# Altium schematic sheet SFPGA.SchDoc: System FPGA
size 594 x 420 mm; CheckedBy: T.Janicki; CompanyName: Creotech Instruments SA; DrawnBy: G.Kasprowicz; Organization: CERN; Address1: European Organization for Nuclear Research; Address2: CH-1211 Genève 23 - Switzerland; Revision: -; SheetNumber: 8; SheetTotal: 11; EDA_Number: EDA-xxxx; Projet: Simple VME FMC Carrier; ModifiedBy: -; CreateDate: 20/11/2012; CheckedDate: 23/01/2012; DivGrp: BE-CO; Designer: G.Kasprowicz; PageSetup: Record=PageOptions|CenterHorizontal=True|CenterVertical=True|PrintScale=0.67|XCorrection=1.00|YCorrection=1.00|PrintKind=1|BorderSize=5000000|LeftOffset=0|BottomOffset=0|Orientation=2|PaperLength=1000|PaperWidth=1000|Scale=100|PaperSource=15|PrintQuality=600|MediaType=1|DitherType=10|PaperKind=A3|PrintScaleMode=1; ModifiedDate: -
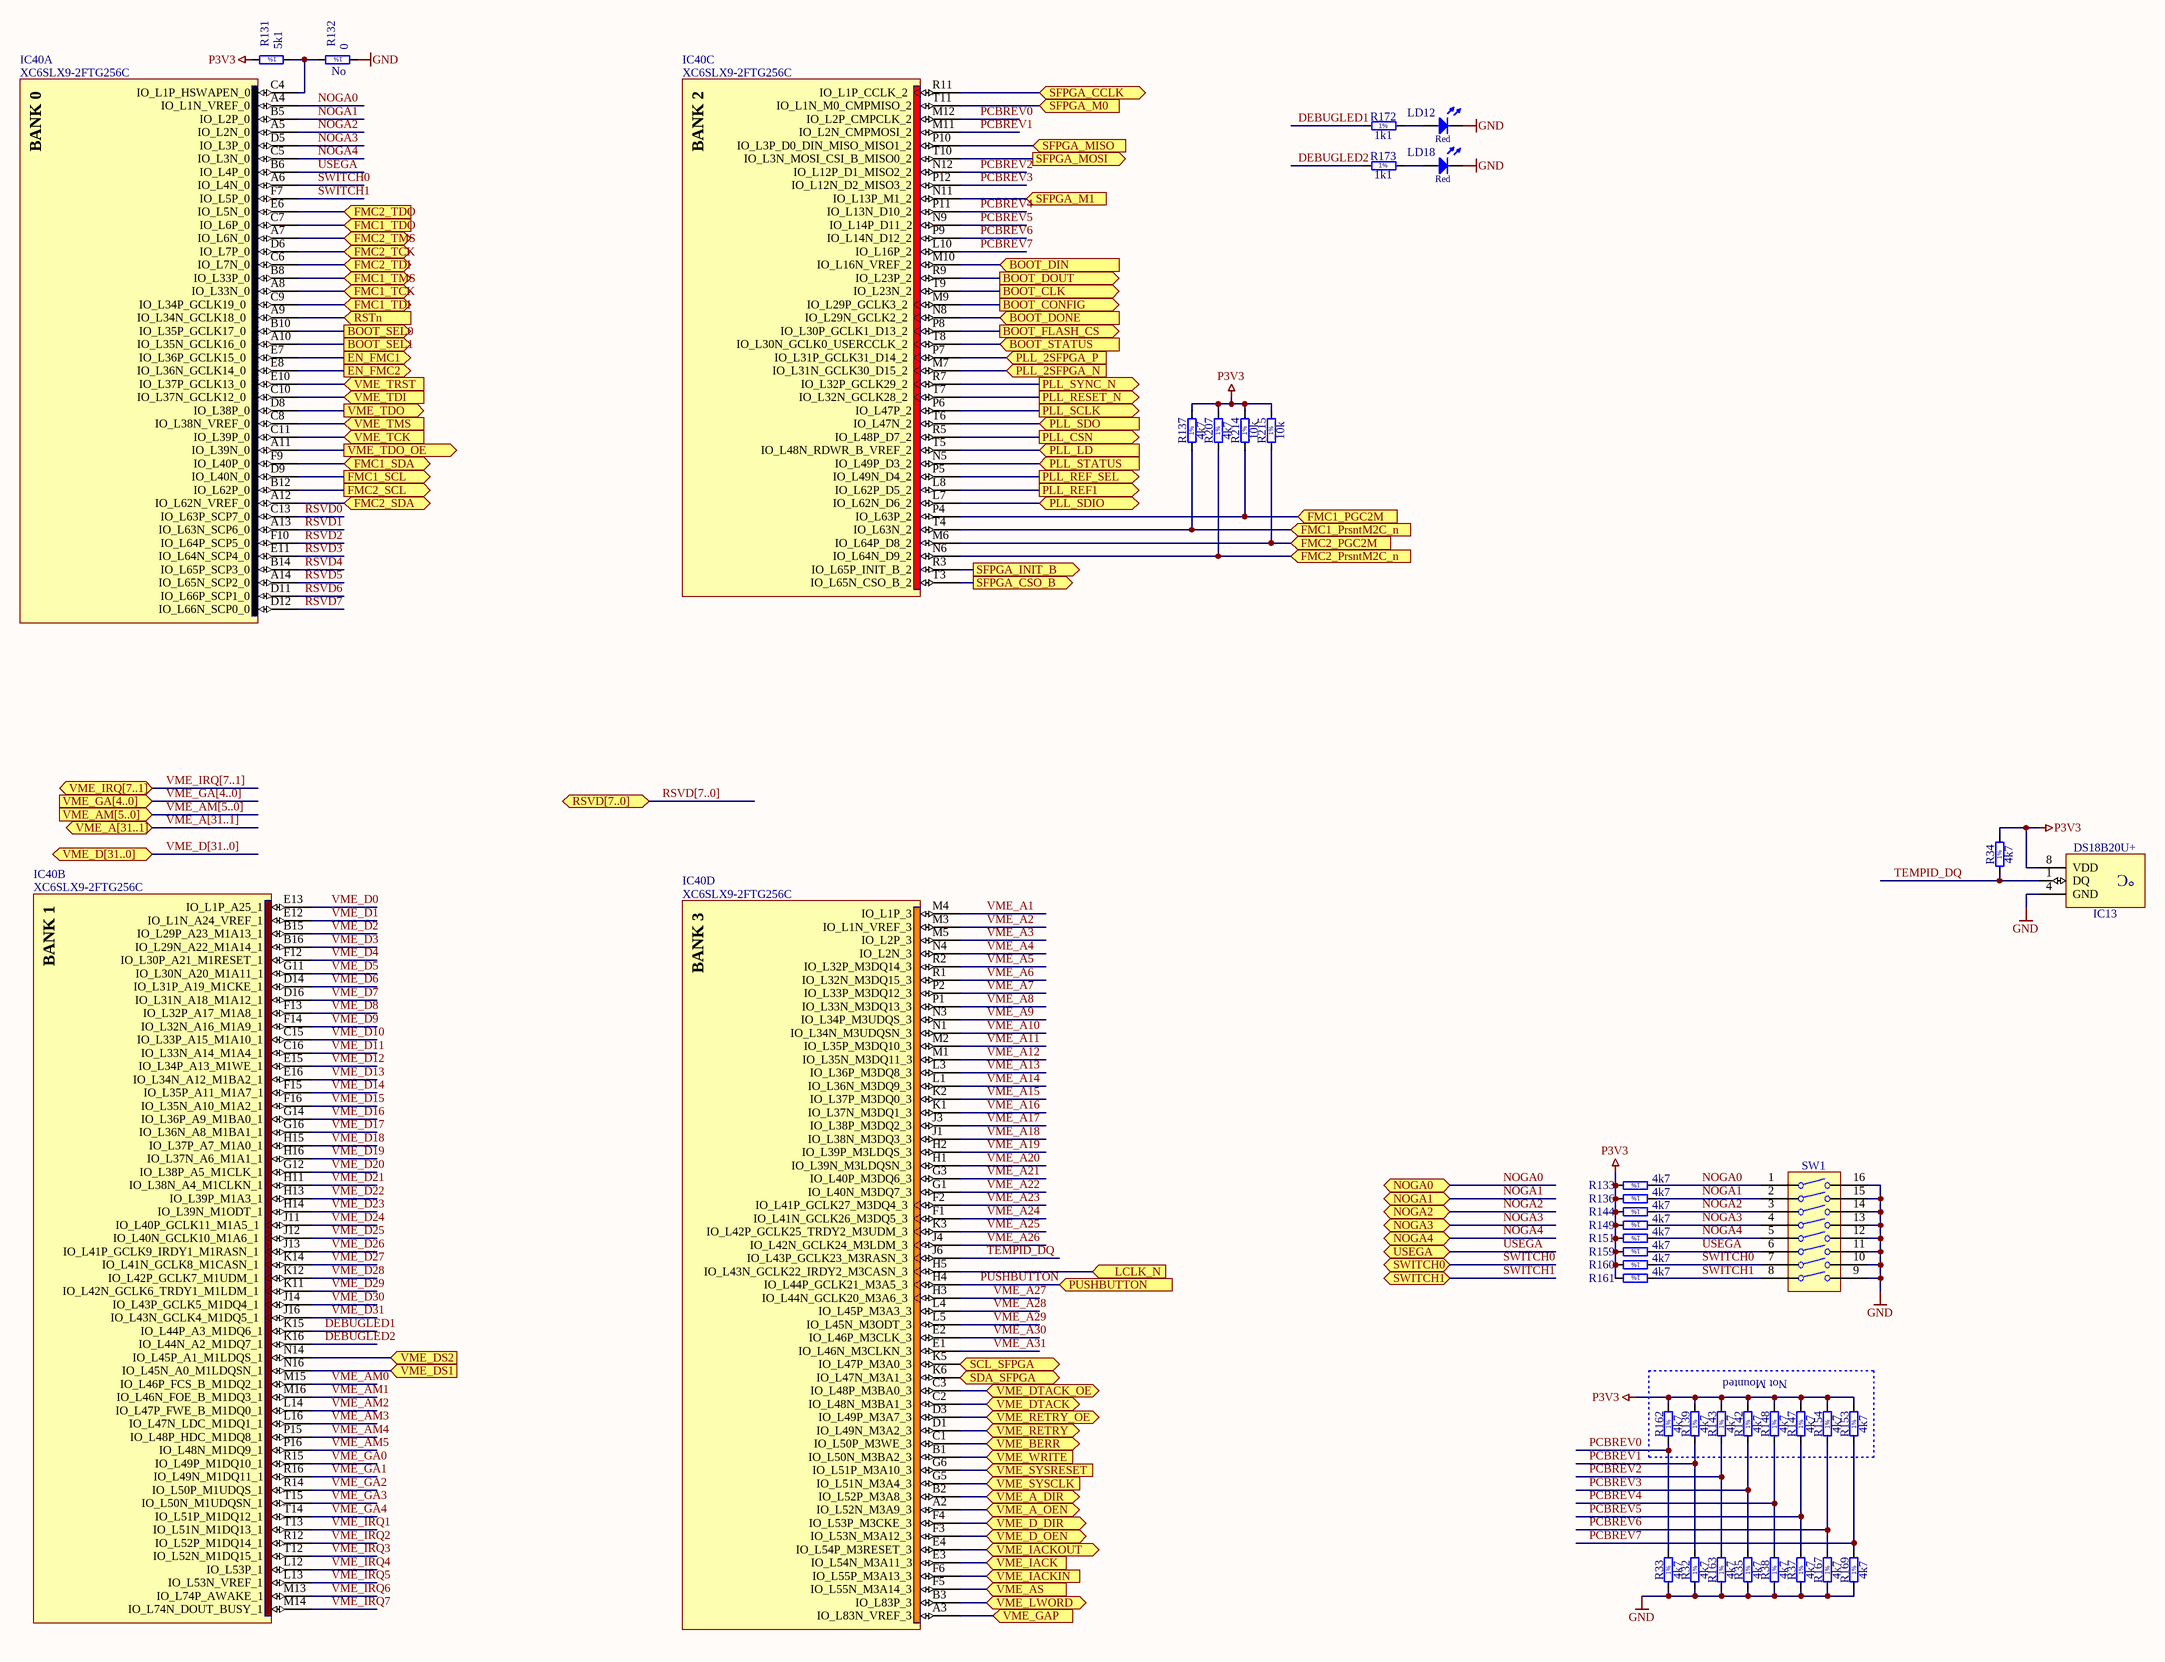
[diagram p0: SFPGA.SchDoc]

## Parts
IC13  DS18B20U+  [SOP65P490X110-8N]
IC40  XC6SLX9-2FTG256C  [BGA256C100P16X16_1700X1700X155]  (parts A,B,C,D of 7)
LD12  Red  [LEDC1608X80N_RED]  (value not drawn)
LD18  Red  [LEDC1608X80N_RED]  (value not drawn)
R32  4k7  [RESC1608X55N]
R33  4k7  [RESC1608X55N]
R34  4k7  [RESC1608X55N]
R35  4k7  [RESC1608X55N]
R37  4k7  [RESC1608X55N]
R38  4k7  [RESC1608X55N]
R131  5k1  [RESC1608X55N]
R132  0  Mounted: No  [RESC1608X55N]
R133  4k7  [RESC1608X55N]
R136  4k7  [RESC1608X55N]
R137  4k7  [RESC1608X55N]
R139  4k7  [RESC1608X55N]
R142  4k7  [RESC1608X55N]
R143  4k7  [RESC1608X55N]
R144  4k7  [RESC1608X55N]
R147  4k7  [RESC1608X55N]
R148  4k7  [RESC1608X55N]
R149  4k7  [RESC1608X55N]
R151  4k7  [RESC1608X55N]
R153  4k7  [RESC1608X55N]
R154  4k7  [RESC1608X55N]
R159  4k7  [RESC1608X55N]
R160  4k7  [RESC1608X55N]
R161  4k7  [RESC1608X55N]
R162  4k7  [RESC1608X55N]
R163  4k7  [RESC1608X55N]
R167  4k7  [RESC1608X55N]
R169  4k7  [RESC1608X55N]
R172  1k1  [RESC1608X55N]
R173  1k1  [RESC1608X55N]
R207  4k7  [RESC1608X55N]
R214  10k  [RESC1608X55N]
R215  10k  [RESC1608X55N]
SW1  Switch  [SW_TYCO_1-1571983-0]  (value not drawn)

## Blocks framed on the sheet
Not Mounted: R139 R142 R143 R147 R148 R153 R154 R162

## Ports
BOOT_CLK (out), BOOT_CONFIG (out), BOOT_DIN (in), BOOT_DONE (in), BOOT_DOUT (out), BOOT_FLASH_CS (out), BOOT_SEL0 (out), BOOT_SEL1 (out), BOOT_STATUS (in), EN_FMC1 (out), EN_FMC2 (out), FMC1_PGC2M (in), FMC1_PrsntM2C_n (in), FMC1_SCL (out), FMC1_SDA (bidir), FMC1_TCK (bidir), FMC1_TDI (bidir), FMC1_TDO (in), FMC1_TMS (bidir), FMC2_PGC2M (in), FMC2_PrsntM2C_n (in), FMC2_SCL (out), FMC2_SDA (bidir), FMC2_TCK (bidir), FMC2_TDI (bidir), FMC2_TDO (in), FMC2_TMS (bidir), LCLK_N (in), NOGA0 (bidir), NOGA1 (bidir), NOGA2 (bidir), NOGA3 (bidir), NOGA4 (bidir), PLL_2SFPGA_N (in), PLL_2SFPGA_P (in), PLL_CSN (out), PLL_LD (in), PLL_REF1 (out), PLL_REF_SEL (out), PLL_RESET_N (out), PLL_SCLK (out), PLL_SDIO (bidir), PLL_SDO (in), PLL_STATUS (in), PLL_SYNC_N (out), PUSHBUTTON (in), RSTn (in), RSVD[7..0] (bidir), SCL_SFPGA (out), SDA_SFPGA (bidir), SFPGA_CCLK (bidir), SFPGA_CSO_B (out), SFPGA_INIT_B (out), SFPGA_M0 (in), SFPGA_M1 (in), SFPGA_MISO (in), SFPGA_MOSI (out), SWITCH0 (bidir), SWITCH1 (bidir), USEGA (bidir), VME_A[31..1] (bidir), VME_A_DIR (bidir), VME_A_OEN (bidir), VME_AM[5..0] (in), VME_AS (in), VME_BERR (bidir), VME_D[31..0] (bidir), VME_D_DIR (bidir), VME_D_OEN (bidir), VME_DS1 (in), VME_DS2 (in), VME_DTACK (bidir), VME_DTACK_OE (bidir), VME_GA[4..0] (in), VME_GAP (in), VME_IACK (in), VME_IACKIN (in), VME_IACKOUT (bidir), VME_IRQ[7..1] (bidir), VME_LWORD (bidir), VME_RETRY (bidir), VME_RETRY_OE (bidir), VME_SYSCLK (in), VME_SYSRESET (in), VME_TCK (in), VME_TDI (in), VME_TDO (out), VME_TDO_OE (out), VME_TMS (in), VME_TRST (in), VME_WRITE (in)

## Nets
GND: IC13.4(GND) LD12.1(C) LD18.1(C) R32.1 R33.1 R35.1 R37.1 R38.1 R132.1 R163.1 R167.1 R169.1 SW1.9 SW1.10 SW1.11 SW1.12 SW1.13 SW1.14 SW1.15 SW1.16
P3V3: IC13.8(VDD) R34.2 R131.2 R133.2 R136.2 R137.2 R139.2 R142.2 R143.2 R144.2 R147.2 R148.2 R149.2 R151.2 R153.2 R154.2 R159.2 R160.2 R161.2 R162.2 R207.2 R214.2 R215.2
BOOT_CLK: IC40.T9(IO_L23N_2) ; port BOOT_CLK
BOOT_CONFIG: IC40.M9(IO_L29P_GCLK3_2) ; port BOOT_CONFIG
BOOT_DIN: IC40.M10(IO_L16N_VREF_2) ; port BOOT_DIN
BOOT_DONE: IC40.N8(IO_L29N_GCLK2_2) ; port BOOT_DONE
BOOT_DOUT: IC40.R9(IO_L23P_2) ; port BOOT_DOUT
BOOT_FLASH_CS: IC40.P8(IO_L30P_GCLK1_D13_2) ; port BOOT_FLASH_CS
BOOT_SEL0: IC40.B10(IO_L35P_GCLK17_0) ; port BOOT_SEL0
BOOT_SEL1: IC40.A10(IO_L35N_GCLK16_0) ; port BOOT_SEL1
BOOT_STATUS: IC40.T8(IO_L30N_GCLK0_USERCCLK_2) ; port BOOT_STATUS
DEBUGLED1: IC40.K15(IO_L44P_A3_M1DQ6_1) R172.1
DEBUGLED2: IC40.K16(IO_L44N_A2_M1DQ7_1) R173.1
EN_FMC1: IC40.E7(IO_L36P_GCLK15_0) ; port EN_FMC1
EN_FMC2: IC40.E8(IO_L36N_GCLK14_0) ; port EN_FMC2
FMC1_PGC2M: IC40.P4(IO_L63P_2) R214.1 ; port FMC1_PGC2M
FMC1_PrsntM2C_n: IC40.T4(IO_L63N_2) R137.1 ; port FMC1_PrsntM2C_n
FMC1_SCL: IC40.D9(IO_L40N_0) ; port FMC1_SCL
FMC1_SDA: IC40.F9(IO_L40P_0) ; port FMC1_SDA
FMC1_TCK: IC40.A8(IO_L33N_0) ; port FMC1_TCK
FMC1_TDI: IC40.C9(IO_L34P_GCLK19_0) ; port FMC1_TDI
FMC1_TDO: IC40.C7(IO_L6P_0) ; port FMC1_TDO
FMC1_TMS: IC40.B8(IO_L33P_0) ; port FMC1_TMS
FMC2_PGC2M: IC40.M6(IO_L64P_D8_2) R215.1 ; port FMC2_PGC2M
FMC2_PrsntM2C_n: IC40.N6(IO_L64N_D9_2) R207.1 ; port FMC2_PrsntM2C_n
FMC2_SCL: IC40.B12(IO_L62P_0) ; port FMC2_SCL
FMC2_SDA: IC40.A12(IO_L62N_VREF_0) ; port FMC2_SDA
FMC2_TCK: IC40.D6(IO_L7P_0) ; port FMC2_TCK
FMC2_TDI: IC40.C6(IO_L7N_0) ; port FMC2_TDI
FMC2_TDO: IC40.E6(IO_L5N_0) ; port FMC2_TDO
FMC2_TMS: IC40.A7(IO_L6N_0) ; port FMC2_TMS
LCLK_N: IC40.H5(IO_L43N_GCLK22_IRDY2_M3CASN_3) ; port LCLK_N
NOGA0: IC40.A4(IO_L1N_VREF_0) R133.1 SW1.1 ; port NOGA0
NOGA1: IC40.B5(IO_L2P_0) R136.1 SW1.2 ; port NOGA1
NOGA2: IC40.A5(IO_L2N_0) R144.1 SW1.3 ; port NOGA2
NOGA3: IC40.D5(IO_L3P_0) R149.1 SW1.4 ; port NOGA3
NOGA4: IC40.C5(IO_L3N_0) R151.1 SW1.5 ; port NOGA4
PCBREV0: IC40.M12(IO_L2P_CMPCLK_2) R33.2 R162.1
PCBREV1: IC40.M11(IO_L2N_CMPMOSI_2) R32.2 R139.1
PCBREV2: IC40.N12(IO_L12P_D1_MISO2_2) R143.1 R163.2
PCBREV3: IC40.P12(IO_L12N_D2_MISO3_2) R35.2 R142.1
PCBREV4: IC40.P11(IO_L13N_D10_2) R38.2 R148.1
PCBREV5: IC40.N9(IO_L14P_D11_2) R37.2 R147.1
PCBREV6: IC40.P9(IO_L14N_D12_2) R154.1 R167.2
PCBREV7: IC40.L10(IO_L16P_2) R153.1 R169.2
PLL_2SFPGA_N: IC40.M7(IO_L31N_GCLK30_D15_2) ; port PLL_2SFPGA_N
PLL_2SFPGA_P: IC40.P7(IO_L31P_GCLK31_D14_2) ; port PLL_2SFPGA_P
PLL_CSN: IC40.R5(IO_L48P_D7_2) ; port PLL_CSN
PLL_LD: IC40.T5(IO_L48N_RDWR_B_VREF_2) ; port PLL_LD
PLL_REF1: IC40.L8(IO_L62P_D5_2) ; port PLL_REF1
PLL_REF_SEL: IC40.P5(IO_L49N_D4_2) ; port PLL_REF_SEL
PLL_RESET_N: IC40.T7(IO_L32N_GCLK28_2) ; port PLL_RESET_N
PLL_SCLK: IC40.P6(IO_L47P_2) ; port PLL_SCLK
PLL_SDIO: IC40.L7(IO_L62N_D6_2) ; port PLL_SDIO
PLL_SDO: IC40.T6(IO_L47N_2) ; port PLL_SDO
PLL_STATUS: IC40.N5(IO_L49P_D3_2) ; port PLL_STATUS
PLL_SYNC_N: IC40.R7(IO_L32P_GCLK29_2) ; port PLL_SYNC_N
PUSHBUTTON: IC40.H4(IO_L44P_GCLK21_M3A5_3) ; port PUSHBUTTON
RSTn: IC40.A9(IO_L34N_GCLK18_0) ; port RSTn
RSVD0: IC40.C13(IO_L63P_SCP7_0)
RSVD1: IC40.A13(IO_L63N_SCP6_0)
RSVD2: IC40.F10(IO_L64P_SCP5_0)
RSVD3: IC40.E11(IO_L64N_SCP4_0)
RSVD4: IC40.B14(IO_L65P_SCP3_0)
RSVD5: IC40.A14(IO_L65N_SCP2_0)
RSVD6: IC40.D11(IO_L66P_SCP1_0)
RSVD7: IC40.D12(IO_L66N_SCP0_0)
SCL_SFPGA: IC40.K5(IO_L47P_M3A0_3) ; port SCL_SFPGA
SDA_SFPGA: IC40.K6(IO_L47N_M3A1_3) ; port SDA_SFPGA
SFPGA_CCLK: IC40.R11(IO_L1P_CCLK_2) ; port SFPGA_CCLK
SFPGA_CSO_B: IC40.T3(IO_L65N_CSO_B_2) ; port SFPGA_CSO_B
SFPGA_INIT_B: IC40.R3(IO_L65P_INIT_B_2) ; port SFPGA_INIT_B
SFPGA_M0: IC40.T11(IO_L1N_M0_CMPMISO_2) ; port SFPGA_M0
SFPGA_M1: IC40.N11(IO_L13P_M1_2) ; port SFPGA_M1
SFPGA_MISO: IC40.P10(IO_L3P_D0_DIN_MISO_MISO1_2) ; port SFPGA_MISO
SFPGA_MOSI: IC40.T10(IO_L3N_MOSI_CSI_B_MISO0_2) ; port SFPGA_MOSI
SWITCH0: IC40.A6(IO_L4N_0) R160.1 SW1.7 ; port SWITCH0
SWITCH1: IC40.F7(IO_L5P_0) R161.1 SW1.8 ; port SWITCH1
TEMPID_DQ: IC13.1(DQ) IC40.J6(IO_L43P_GCLK23_M3RASN_3) R34.1
USEGA: IC40.B6(IO_L4P_0) R159.1 SW1.6 ; port USEGA
VME_A1: IC40.M4(IO_L1P_3)
VME_A2: IC40.M3(IO_L1N_VREF_3)
VME_A3: IC40.M5(IO_L2P_3)
VME_A4: IC40.N4(IO_L2N_3)
VME_A5: IC40.R2(IO_L32P_M3DQ14_3)
VME_A6: IC40.R1(IO_L32N_M3DQ15_3)
VME_A7: IC40.P2(IO_L33P_M3DQ12_3)
VME_A8: IC40.P1(IO_L33N_M3DQ13_3)
VME_A9: IC40.N3(IO_L34P_M3UDQS_3)
VME_A10: IC40.N1(IO_L34N_M3UDQSN_3)
VME_A11: IC40.M2(IO_L35P_M3DQ10_3)
VME_A12: IC40.M1(IO_L35N_M3DQ11_3)
VME_A13: IC40.L3(IO_L36P_M3DQ8_3)
VME_A14: IC40.L1(IO_L36N_M3DQ9_3)
VME_A15: IC40.K2(IO_L37P_M3DQ0_3)
VME_A16: IC40.K1(IO_L37N_M3DQ1_3)
VME_A17: IC40.J3(IO_L38P_M3DQ2_3)
VME_A18: IC40.J1(IO_L38N_M3DQ3_3)
VME_A19: IC40.H2(IO_L39P_M3LDQS_3)
VME_A20: IC40.H1(IO_L39N_M3LDQSN_3)
VME_A21: IC40.G3(IO_L40P_M3DQ6_3)
VME_A22: IC40.G1(IO_L40N_M3DQ7_3)
VME_A23: IC40.F2(IO_L41P_GCLK27_M3DQ4_3)
VME_A24: IC40.F1(IO_L41N_GCLK26_M3DQ5_3)
VME_A25: IC40.K3(IO_L42P_GCLK25_TRDY2_M3UDM_3)
VME_A26: IC40.J4(IO_L42N_GCLK24_M3LDM_3)
VME_A27: IC40.H3(IO_L44N_GCLK20_M3A6_3)
VME_A28: IC40.L4(IO_L45P_M3A3_3)
VME_A29: IC40.L5(IO_L45N_M3ODT_3)
VME_A30: IC40.E2(IO_L46P_M3CLK_3)
VME_A31: IC40.E1(IO_L46N_M3CLKN_3)
VME_A_DIR: IC40.B2(IO_L52P_M3A8_3) ; port VME_A_DIR
VME_A_OEN: IC40.A2(IO_L52N_M3A9_3) ; port VME_A_OEN
VME_AM0: IC40.M15(IO_L46P_FCS_B_M1DQ2_1)
VME_AM1: IC40.M16(IO_L46N_FOE_B_M1DQ3_1)
VME_AM2: IC40.L14(IO_L47P_FWE_B_M1DQ0_1)
VME_AM3: IC40.L16(IO_L47N_LDC_M1DQ1_1)
VME_AM4: IC40.P15(IO_L48P_HDC_M1DQ8_1)
VME_AM5: IC40.P16(IO_L48N_M1DQ9_1)
VME_AS: IC40.F5(IO_L55N_M3A14_3) ; port VME_AS
VME_BERR: IC40.C1(IO_L50P_M3WE_3) ; port VME_BERR
VME_D0: IC40.E13(IO_L1P_A25_1)
VME_D1: IC40.E12(IO_L1N_A24_VREF_1)
VME_D2: IC40.B15(IO_L29P_A23_M1A13_1)
VME_D3: IC40.B16(IO_L29N_A22_M1A14_1)
VME_D4: IC40.F12(IO_L30P_A21_M1RESET_1)
VME_D5: IC40.G11(IO_L30N_A20_M1A11_1)
VME_D6: IC40.D14(IO_L31P_A19_M1CKE_1)
VME_D7: IC40.D16(IO_L31N_A18_M1A12_1)
VME_D8: IC40.F13(IO_L32P_A17_M1A8_1)
VME_D9: IC40.F14(IO_L32N_A16_M1A9_1)
VME_D10: IC40.C15(IO_L33P_A15_M1A10_1)
VME_D11: IC40.C16(IO_L33N_A14_M1A4_1)
VME_D12: IC40.E15(IO_L34P_A13_M1WE_1)
VME_D13: IC40.E16(IO_L34N_A12_M1BA2_1)
VME_D14: IC40.F15(IO_L35P_A11_M1A7_1)
VME_D15: IC40.F16(IO_L35N_A10_M1A2_1)
VME_D16: IC40.G14(IO_L36P_A9_M1BA0_1)
VME_D17: IC40.G16(IO_L36N_A8_M1BA1_1)
VME_D18: IC40.H15(IO_L37P_A7_M1A0_1)
VME_D19: IC40.H16(IO_L37N_A6_M1A1_1)
VME_D20: IC40.G12(IO_L38P_A5_M1CLK_1)
VME_D21: IC40.H11(IO_L38N_A4_M1CLKN_1)
VME_D22: IC40.H13(IO_L39P_M1A3_1)
VME_D23: IC40.H14(IO_L39N_M1ODT_1)
VME_D24: IC40.J11(IO_L40P_GCLK11_M1A5_1)
VME_D25: IC40.J12(IO_L40N_GCLK10_M1A6_1)
VME_D26: IC40.J13(IO_L41P_GCLK9_IRDY1_M1RASN_1)
VME_D27: IC40.K14(IO_L41N_GCLK8_M1CASN_1)
VME_D28: IC40.K12(IO_L42P_GCLK7_M1UDM_1)
VME_D29: IC40.K11(IO_L42N_GCLK6_TRDY1_M1LDM_1)
VME_D30: IC40.J14(IO_L43P_GCLK5_M1DQ4_1)
VME_D31: IC40.J16(IO_L43N_GCLK4_M1DQ5_1)
VME_D_DIR: IC40.F4(IO_L53P_M3CKE_3) ; port VME_D_DIR
VME_D_OEN: IC40.F3(IO_L53N_M3A12_3) ; port VME_D_OEN
VME_DS1: IC40.N16(IO_L45N_A0_M1LDQSN_1) ; port VME_DS1
VME_DS2: IC40.N14(IO_L45P_A1_M1LDQS_1) ; port VME_DS2
VME_DTACK: IC40.C2(IO_L48N_M3BA1_3) ; port VME_DTACK
VME_DTACK_OE: IC40.C3(IO_L48P_M3BA0_3) ; port VME_DTACK_OE
VME_GA0: IC40.R15(IO_L49P_M1DQ10_1)
VME_GA1: IC40.R16(IO_L49N_M1DQ11_1)
VME_GA2: IC40.R14(IO_L50P_M1UDQS_1)
VME_GA3: IC40.T15(IO_L50N_M1UDQSN_1)
VME_GA4: IC40.T14(IO_L51P_M1DQ12_1)
VME_GAP: IC40.A3(IO_L83N_VREF_3) ; port VME_GAP
VME_IACK: IC40.E3(IO_L54N_M3A11_3) ; port VME_IACK
VME_IACKIN: IC40.F6(IO_L55P_M3A13_3) ; port VME_IACKIN
VME_IACKOUT: IC40.E4(IO_L54P_M3RESET_3) ; port VME_IACKOUT
VME_IRQ1: IC40.T13(IO_L51N_M1DQ13_1)
VME_IRQ2: IC40.R12(IO_L52P_M1DQ14_1)
VME_IRQ3: IC40.T12(IO_L52N_M1DQ15_1)
VME_IRQ4: IC40.L12(IO_L53P_1)
VME_IRQ5: IC40.L13(IO_L53N_VREF_1)
VME_IRQ6: IC40.M13(IO_L74P_AWAKE_1)
VME_IRQ7: IC40.M14(IO_L74N_DOUT_BUSY_1)
VME_LWORD: IC40.B3(IO_L83P_3) ; port VME_LWORD
VME_RETRY: IC40.D1(IO_L49N_M3A2_3) ; port VME_RETRY
VME_RETRY_OE: IC40.D3(IO_L49P_M3A7_3) ; port VME_RETRY_OE
VME_SYSCLK: IC40.G5(IO_L51N_M3A4_3) ; port VME_SYSCLK
VME_SYSRESET: IC40.G6(IO_L51P_M3A10_3) ; port VME_SYSRESET
VME_TCK: IC40.C11(IO_L39P_0) ; port VME_TCK
VME_TDI: IC40.C10(IO_L37N_GCLK12_0) ; port VME_TDI
VME_TDO: IC40.D8(IO_L38P_0) ; port VME_TDO
VME_TDO_OE: IC40.A11(IO_L39N_0) ; port VME_TDO_OE
VME_TMS: IC40.C8(IO_L38N_VREF_0) ; port VME_TMS
VME_TRST: IC40.E10(IO_L37P_GCLK13_0) ; port VME_TRST
VME_WRITE: IC40.B1(IO_L50N_M3BA2_3) ; port VME_WRITE
NetIC40_C4: IC40.C4(IO_L1P_HSWAPEN_0) R131.1 R132.2
NetLD12_2: LD12.2(A) R172.2
NetLD18_2: LD18.2(A) R173.2

## Buses and harness runs
bus RSVD[7..0] = port RSVD[7..0]
bus VME_A[31..1] = port VME_A[31..1]
bus VME_AM[5..0] = port VME_AM[5..0]
bus VME_D[31..0] = port VME_D[31..0]
bus VME_GA[4..0] = port VME_GA[4..0]
bus VME_IRQ[7..1] = port VME_IRQ[7..1]

## Notes on the sheet
- Project/Equipment
- Document
- File
- Designer
- Drawn by
- Check.by
- Last Mod.
- Print Date
- Sheet
- Size
- A2
- of
- Rev
- (in symbol DS18B20U+) °C
- (in symbol R0603_0R_JUMPER) 1%
- (in symbol R0603_1K1_1%_0.1W_100PPM) 1%
- (in symbol R0603_4K7_1%_0.1W_100PPM) 1%
- (in symbol R0603_5K1_1%_0.1W_100PPM) 1%
- (in symbol R0603_10K_1%_0.1W_100PPM) 1%
- (in symbol XC6SLX9-2FTG256C, part A) BANK 0
- (in symbol XC6SLX9-2FTG256C, part B) BANK 1
- (in symbol XC6SLX9-2FTG256C, part C) BANK 2
- (in symbol XC6SLX9-2FTG256C, part D) BANK 3

## Library data of the parts
IC13 = DS18B20U+: Programmable Resolution 1-Wire Digital Thermometer; Part Description: Programmable Resolution 1-Wire Digital Thermometer (-55°C to +125°C); Manufacturer: DALLAS MAXIM; Table: Sensors; Part Number: DS18B20U+; Component Kind: Standard; Component Type: Standard; Device: DS18B20U+; PackageDescription: SOP, 0.65mm pitch; 8 pin, 3.00mm W X 3.00mm L X 1.10mm H body, IPC Medium Density; Manufacturer Part Number: DS18B20U+; Pin Count: 3; Case: uSOP8; Mounted: Yes; Socket: No; SMD: Yes; ComponentHeight: 1.1mm; HelpURL: \\cern.ch\dfs\Applications\Altium\Datasheets\DS18B20U+.pdf; Author: CERN DEM JLC; CreateDate: 3/17/2010; LatestRevisionDate: 3/17/2010
IC40 = XC6SLX9-2FTG256C: Spartan-6 LX 1.2V FPGA, 186 User I/Os, 256-Ball Fine-Pitch Thin BGA (1.0mm Pitch), Speed Grade 2, Commercial Grade, Pb-Free; Manufacturer: XILINX; Table: Logic; Part Number: XC6SLX9-2FTG256C; Component Kind: Standard; Component Type: Standard; Device: XC6SLX9-2FTG256C; PackageDescription: BGA 1mm, Pitch, Square 256 Pin, 16 Columns x 16 Rows, Body 17mm X 17mm X 1.55mm H; Part Description: Spartan-6 LX 1.2V FPGA, 186 User I/Os, 256-Ball Fine-Pitch Thin BGA (1.0mm Pitch), Speed Grade 2, Commercial Grade, Pb-Free; Manufacturer Part Number: XC6SLX9-2FTG256C; Pin Count: 256; Case: BGA256; Mounted: Yes; Socket: No; SMD: Yes; ComponentHeight: 1.55mm; HelpURL: \\cern.ch\dfs\Applications\Altium\Datasheets\XC6SLX9-2FTG256C.pdf; ComponentLink1URL: \\cern.ch\dfs\Applications\Altium\Datasheets\XC6SLX9-2FTG256C_Package-Pinout.pdf; ComponentLink1Description: Package/Pinouts; Author: CERN DEM JLC; CreateDate: 2011-11-01; LatestRevisionDate: 2011-11-01
LD12 LD18 = LED_ROHM_SML-311UTT86K: LED Red 1C 2A; Part Description: Low current chip LED SML-311 Serie; Manufacturer: ROHM; Table: LEDs & Displays; Part Number: LED_ROHM_SML-311UTT86K; Component Kind: Standard; Component Type: Standard; Color: Red; PackageDescription: Chip RED LED, 2-Leads, Body 1.6x0.8mm, IPC Medium Density; Manufacturer Part Number: SML-311UTT86K; Pin Count: 2; Mounted: Yes; Socket: No; SMD: Yes; ComponentHeight: 0.8mm; HelpURL: \\cern.ch\dfs\Applications\Altium\Datasheets\LED_ROHM_SML-311UTT86K.pdf; Author: CERN DEM JLC; CreateDate: 3/16/2010; LatestRevisionDate: 3/17/2010
R32-R35 R37 R38 R133 R136 R137 R144 R149 R151 R159-R161 R163 R167 R169 R207 = R0603_4K7_1%_0.1W_100PPM: Resistor - 1%; Part Description: General Purpose Thick Film Chip Resistor; Manufacturer: GENERIC; Manufacturer1 Part Number: NRC06F4701TRF; Power: 0.1W; TC: ±100ppm/°C; Table: Resistors SMD; Part Number: R0603_4K7_1%_0.1W_100PPM; Component Kind: Standard; Component Type: Standard; Pin Count: 2; Value: 4k7; Status: Preferred; Tolerance: ±1%; Manufacturer Part Number: R0603_4K7_1%_0.1W_100PPM; Case: 0603; Mounted: Yes; Socket: No; SMD: Yes; Manufacturer1 Example: NIC COMPONENT; Manufacturer1 ComponentHeight: 0.55mm; HelpURL: \\cern.ch\dfs\Applications\Altium\Datasheets\R0603_NIC_NRC.pdf; Author: CERN DEM JLC
  R32-R35 R37 R38 R133 R136 R144 R149 R151 R159-R161 R163 R167 R169: CreateDate: 03/12/2007; LatestRevisionDate: 13/03/2008
  R137 R207: CreateDate: 2007-12-03; LatestRevisionDate: 2008-03-13
R131 = R0603_5K1_1%_0.1W_100PPM: Resistor - 1%; Part Description: General Purpose Thick Film Chip Resistor; Manufacturer: GENERIC; Manufacturer1 Part Number: NRC06F5101TRF; Power: 0.1W; TC: ±100ppm/°C; Table: Resistors SMD; Part Number: R0603_5K1_1%_0.1W_100PPM; Component Kind: Standard; Component Type: Standard; Pin Count: 2; Value: 5k1; Status: Preferred; Tolerance: ±1%; Manufacturer Part Number: R0603_5K1_1%_0.1W_100PPM; Case: 0603; Mounted: Yes; Socket: No; SMD: Yes; Manufacturer1 Example: NIC COMPONENT; Manufacturer1 ComponentHeight: 0.55mm; HelpURL: \\cern.ch\dfs\Applications\Altium\Datasheets\R0603_NIC_NRC.pdf; Author: CERN DEM JLC; CreateDate: 03/12/2007; LatestRevisionDate: 13/03/2008
R132 = R0603_0R_JUMPER: Resistor - 1%; Part Description: 1A (0.05R Max DC Resistance) Zero Ohm Jumper; Manufacturer: GENERIC; Manufacturer1 Part Number: NRC06Z0; Table: Resistors SMD; Part Number: R0603_0R_JUMPER; Component Kind: Standard; Component Type: Standard; Pin Count: 2; Value: 0; Status: Preferred; Manufacturer Part Number: R0603_0R_JUMPER; Case: 0603; Socket: No; SMD: Yes; Manufacturer1 Example: NIC COMPONENT; Manufacturer1 ComponentHeight: 0.55mm; HelpURL: \\cern.ch\dfs\Applications\Altium\Datasheets\R0603_NIC_NRC.pdf; Author: CERN DEM JLC; CreateDate: 12/3/2007; LatestRevisionDate: 3/13/2008
R139 R142 R143 R147 R148 R153 R154 R162 = R0603_4K7_1%_0.1W_100PPM: Resistor - 1%; Part Description: General Purpose Thick Film Chip Resistor; Manufacturer: GENERIC; Manufacturer1 Part Number: NRC06F4701TRF; Power: 0.1W; TC: ±100ppm/°C; Mounted: No; Table: Resistors SMD; Part Number: R0603_4K7_1%_0.1W_100PPM; Component Kind: Standard; Component Type: Standard; Pin Count: 2; Value: 4k7; Status: Preferred; Tolerance: ±1%; Manufacturer Part Number: R0603_4K7_1%_0.1W_100PPM; Case: 0603; Socket: No; SMD: Yes; Manufacturer1 Example: NIC COMPONENT; Manufacturer1 ComponentHeight: 0.55mm; HelpURL: \\cern.ch\dfs\Applications\Altium\Datasheets\R0603_NIC_NRC.pdf; Author: CERN DEM JLC; CreateDate: 03/12/2007; LatestRevisionDate: 13/03/2008
R172 R173 = R0603_1K1_1%_0.1W_100PPM: Resistor - 1%; Part Description: General Purpose Thick Film Chip Resistor; Manufacturer: GENERIC; Manufacturer1 Part Number: NRC06F1101TRF; Power: 0.1W; TC: ±100ppm/°C; Table: Resistors SMD; Part Number: R0603_1K1_1%_0.1W_100PPM; Component Kind: Standard; Component Type: Standard; Pin Count: 2; Value: 1k1; Status: Preferred; Tolerance: ±1%; Manufacturer Part Number: R0603_1K1_1%_0.1W_100PPM; Case: 0603; Mounted: Yes; Socket: No; SMD: Yes; Manufacturer1 Example: NIC COMPONENT; Manufacturer1 ComponentHeight: 0.55mm; HelpURL: \\cern.ch\dfs\Applications\Altium\Datasheets\R0603_NIC_NRC.pdf; Author: CERN DEM JLC; CreateDate: 2007-12-03; LatestRevisionDate: 2008-03-13
R214 R215 = R0603_10K_1%_0.1W_100PPM: Resistor - 1%; Part Description: General Purpose Thick Film Chip Resistor; Manufacturer: GENERIC; Manufacturer1 Part Number: NRC06F1002TRF; Power: 0.1W; TC: ±100ppm/°C; Table: Resistors SMD; Part Number: R0603_10K_1%_0.1W_100PPM; Component Kind: Standard; Component Type: Standard; Pin Count: 2; Value: 10k; Status: Preferred; Tolerance: ±1%; Manufacturer Part Number: R0603_10K_1%_0.1W_100PPM; Case: 0603; Mounted: Yes; Socket: No; SMD: Yes; Manufacturer1 Example: NIC COMPONENT; Manufacturer1 ComponentHeight: 0.55mm; HelpURL: \\cern.ch\dfs\Applications\Altium\Datasheets\R0603_NIC_NRC.pdf; Author: CERN DEM JLC; CreateDate: 2007-12-03; LatestRevisionDate: 2008-03-13
SW1 = SW_TYCO_1-1571983-0: 8 Ways SPST DIP Switch; Part Description: 8 Way SPST SMD DIP Switch, Latched, Contact Rating 0.025A 24VDC; Manufacturer: TYCO; Manufacturer Part Number: 1-1571983-0 or GDH08S04; Table: Switches; Part Number: SW_TYCO_1-1571983-0; Component Kind: Standard; Component Type: Standard; Pin Count: 16; PackageDescription: Pitch 1.27mm,  Body 11.28x6.2mm, 8 Ways SPST Surface-Mount DIP Switch,TYCO GDH Serie; Family: Switch; Mounted: Yes; Socket: No; SMD: Yes; Status: None; ComponentHeight: 2.31mm; HelpURL: \\cern.ch\dfs\Applications\Altium\Datasheets\SW_TYCO_1-1571983-0.pdf; Author: CERN DEM JLC; CreateDate: 08/01/2009; LatestRevisionDate: 08/01/2009